# Altium schematic sheet PowerDrivers.SchDoc
size A4; SheetNumber: 6; SheetTotal: 6
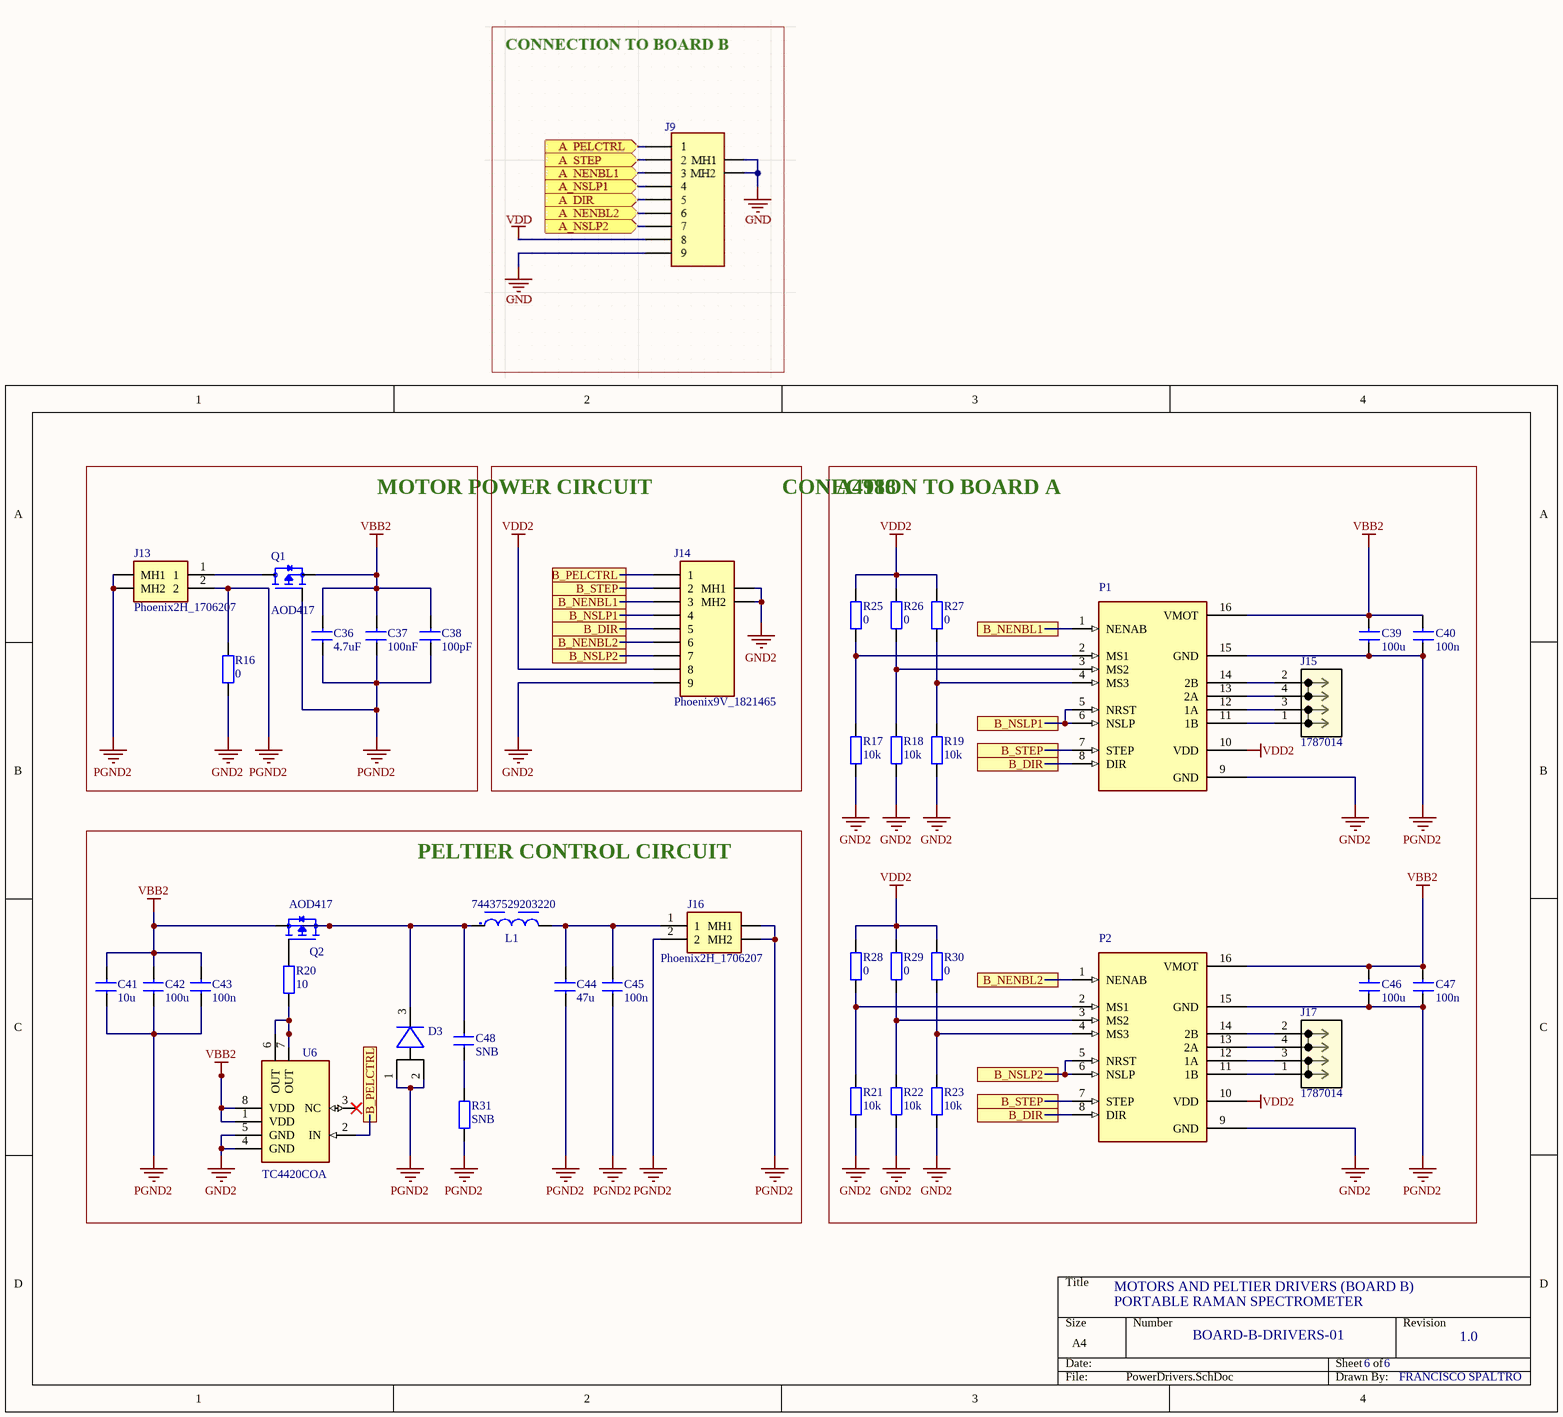
[diagram p0: PowerDrivers.SchDoc]

## Parts
C36  4.7uF  [RES_0805]
C37  100nF  [RES_0805]
C38  100pF  [RES_0805]
C39  100u  [RES_0805]
C40  100n  [RES_0805]
C41  10u  [RES_0805]
C42  100u  [RES_0805]
C43  100n  [RES_0805]
C44  47u  [RES_0805]
C45  100n  [RES_0805]
C46  100u  [RES_0805]
C47  100n  [RES_0805]
C48  SNB  [RES_0805]
D3  DIODE_FSV15150V  [FSV15150V_TO-277]  (value not drawn)
J13  Phoenix2H_1706207  [PHOENIX_1706207]
J14  Phoenix9V_1821465  [PHOENIX_1821465]
J15  1787014  [CONN4_1787014_PXC]
J16  Phoenix2H_1706207  [PHOENIX_1706207]
J17  1787014  [CONN4_1787014_PXC]
L1  74437529203220  [WE-HCF_2920_ROUND]
P1  2x8_PINES  [PINES8x2-sep]  (value not drawn)
P2  2x8_PINES  [PINES8x2-sep]  (value not drawn)
Q1  AOD417  [DPAK228P994X240_3N]
Q2  AOD417  [DPAK228P994X240_3N]
R16  0  [RES_0805]
R17  10k  [RES_0805]
R18  10k  [RES_0805]
R19  10k  [RES_0805]
R20  10  [RES_0805]
R21  10k  [RES_0805]
R22  10k  [RES_0805]
R23  10k  [RES_0805]
R25  0  [RES_0805]
R26  0  [RES_0805]
R27  0  [RES_0805]
R28  0  [RES_0805]
R29  0  [RES_0805]
R30  0  [RES_0805]
R31  SNB  [RES_0805]
U6  TC4420COA  [SOIC127P599X175-8N]

## Blocks framed on the sheet
MOTOR POWER CIRCUIT: C36-C38 J13 Q1 R16
CONECTION TO BOARD A: J14
A4988: C39 C40 C46 C47 J15 J17 P1 P2 R17-R19 R21-R23 R25-R30
PELTIER CONTROL CIRCUIT: C41-C45 C48 D3 J16 L1 Q2 R20 R31 U6

## Nets
GND2: J14.9 J14.MH1 J14.MH2 P1.9(GND) P2.9(GND) R16.1 R17.1 R18.1 R19.1 R21.1 R22.1 R23.1 U6.4(GND) U6.5(GND)
PGND2: C36.1 C37.1 C38.1 C39.2 C40.2 C41.1 C42.1 C43.1 C44.1 C45.1 C46.2 C47.2 D3.1(A) D3.2 J13.2 J13.MH1 J13.MH2 J16.2 J16.MH1 J16.MH2 P1.15(GND) P2.15(GND) Q1.1(G) R16.2 R31.1
VBB2: C36.2 C37.2 C38.2 C39.1 C40.1 C41.2 C42.2 C43.2 C46.1 C47.1 P1.16(VMOT) P2.16(VMOT) Q1.3(S) Q2.3(S) U6.1(VDD) U6.8(VDD)
VDD2: J14.8 P1.10(VDD) P2.10(VDD) R25.2 R26.2 R27.2 R28.2 R29.2 R30.2
B_DIR: J14.5 P1.8(DIR) P2.8(DIR)
B_NENBL1: J14.3 P1.1(NENAB)
B_NENBL2: J14.6 P2.1(NENAB)
B_NSLP1: J14.4 P1.5(NRST) P1.6(NSLP)
B_NSLP2: J14.7 P2.5(NRST) P2.6(NSLP)
B_PELCTRL: J14.1 U6.2(IN)
B_STEP: J14.2 P1.7(STEP) P2.7(STEP)
NetC44_2: C44.2 C45.2 J16.1 L1.2
NetC48_1: C48.1 R31.2
NetC48_2: C48.2 D3.3(C) L1.1 Q2.4(D)
NetJ13_1: J13.1 Q1.4(D)
NetJ15_1: J15.1 P1.11(1B)
NetJ15_2: J15.2 P1.14(2B)
NetJ15_3: J15.3 P1.12(1A)
NetJ15_4: J15.4 P1.13(2A)
NetJ17_1: J17.1 P2.11(1B)
NetJ17_2: J17.2 P2.14(2B)
NetJ17_3: J17.3 P2.12(1A)
NetJ17_4: J17.4 P2.13(2A)
NetP1_2: P1.2(MS1) R17.2 R25.1
NetP1_3: P1.3(MS2) R18.2 R26.1
NetP1_4: P1.4(MS3) R19.2 R27.1
NetP2_2: P2.2(MS1) R21.2 R28.1
NetP2_3: P2.3(MS2) R22.2 R29.1
NetP2_4: P2.4(MS3) R23.2 R30.1
NetQ2_1: Q2.1(G) R20.2
NetR20_1: R20.1 U6.6(OUT) U6.7(OUT)

Not connected (* = marked no-connect by the designer): U6 3(NC)*

## Notes on the sheet
- MOTORS AND PELTIER DRIVERS (BOARD B)
- PORTABLE RAMAN SPECTROMETER
- BOARD-B-DRIVERS-01
- 6
- 1.0
- FRANCISCO SPALTRO

## Library data of the parts
C36-C48 = CAP_0805: Generic Capacitor
J14 = Phoenix9V_1821465: MF: {'manufacturer': u'Phoenix Contact'}; Package: None; Price: None; Value: *; MP: 1821465; Availability: Unavailable
J15 J17 = Phoenix_1787014_4P: PCB headers, nominal cross section: 1.5 mmÂ², color: black, nominal current: 8 A, rated voltage (III/2): 160 V, contact surface: Tin, contact connection type: Pin, number of potentials: 4, number of rows: 2, number of positions: 2, number of connections: 4, product range: DMC 1,5/..-G1F-THR, pitch: 3.5 mm, mounting: THR soldering, pin layout: Linear pinning, solder pin [P]: 2 mm, number of solder pins per potential: 1, plug-in system: COMBICON DFMC 1,5, Pin connector pattern alignment: Standard, locking: Snap-in locking, mounting: Lock &amp; release threaded flange, type of packaging: packed in cardboard; Manufacturer_Name: Phoenix Contact; Type: Headers, Plugs and Sockets; Copyright: Copyright (C) 2025 Ultra Librarian. All rights reserved.; Manufacturer_Part_Number: 1787014; RefDes: RefDes
L1 = 22uH_74437529203220: MF: {'manufacturer': u'W\xfcrth Elektronik'}; Package: None; Price: None; Value: *; MP: 74437529203220; Availability: Unavailable
Q1 Q2 = AOD417: P-Channel 30V 25A _Ta_ 2.5W _Ta_, 50W _Tc_ Surface Mount TO-252, _D-Pak_; MF: Alpha &; SnapEDA_Link: https://www.snapeda.com/parts/AOD417/Alpha%20%26%20Omega%20Semiconductor%20Inc./view-part/454934/?ref=snap; Availability: Unavailable; MP: AOD417; Price: None; Package: TO-252 Alpha &amp; Omega Semiconductor; Value: *
R16-R23 R25-R31 = RES_0805: Generic Capacitor
U6 = TC4420COA: Microchip TC4420COA,MOSFET Power Driver 6A,4.5 to 18V,Non-Inverting,8-Pin SOIC | Microchip Technology Inc. TC4420COA; SnapEDA_Link: https://www.snapeda.com/parts/TC4420COA/Microchip/view-part/?ref=snap; Package: SOIC-8 Microchip; Value: *; MF: Microchip Technology; MP: TC4420COA; Check_prices: https://www.snapeda.com/parts/TC4420COA/Microchip/view-part/?ref=eda
J13 J16 = Phoenix2H_1706207: Package: None; Price: None; Value: *; MP: 1706207; Availability: Unavailable